# EAGLE design lights (EAGLE 6.6.0)
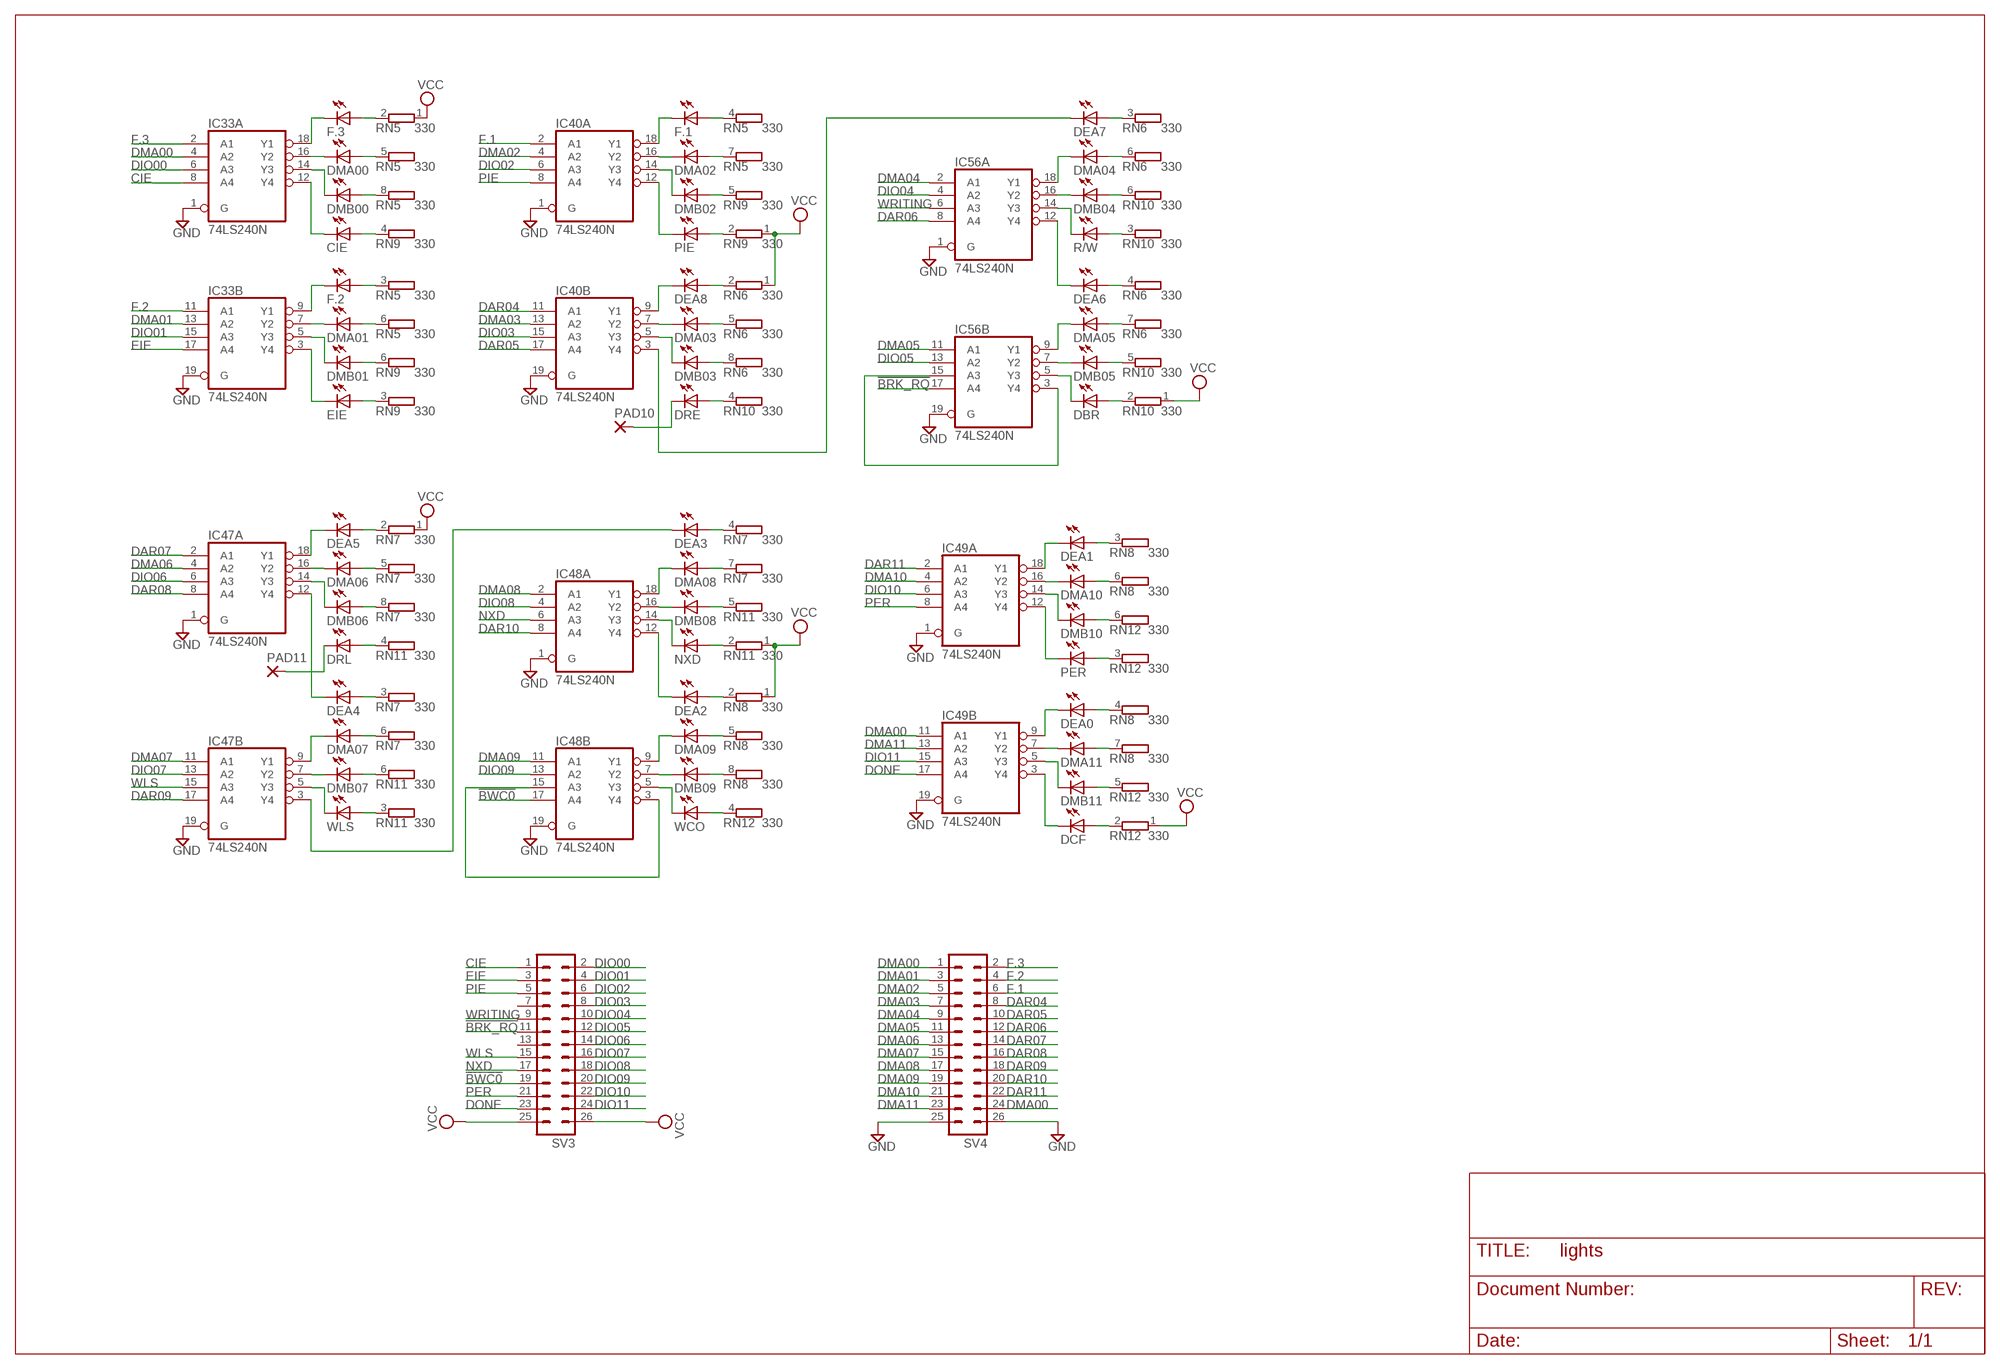
[diagram p0: schematic, sheet 1]

## Parts
CIE  LED5MM  [LED5MM]
DBR  LED5MM  [LED5MM]
DCF  LED5MM  [LED5MM]
DEA0  LED5MM  [LED5MM]
DEA1  LED5MM  [LED5MM]
DEA2  LED5MM  [LED5MM]
DEA3  LED5MM  [LED5MM]
DEA4  LED5MM  [LED5MM]
DEA5  LED5MM  [LED5MM]
DEA6  LED5MM  [LED5MM]
DEA7  LED5MM  [LED5MM]
DEA8  LED5MM  [LED5MM]
DMA00  LED5MM  [LED5MM]
DMA01  LED5MM  [LED5MM]
DMA02  LED5MM  [LED5MM]
DMA03  LED5MM  [LED5MM]
DMA04  LED5MM  [LED5MM]
DMA05  LED5MM  [LED5MM]
DMA06  LED5MM  [LED5MM]
DMA07  LED5MM  [LED5MM]
DMA08  LED5MM  [LED5MM]
DMA09  LED5MM  [LED5MM]
DMA10  LED5MM  [LED5MM]
DMA11  LED5MM  [LED5MM]
DMB00  LED5MM  [LED5MM]
DMB01  LED5MM  [LED5MM]
DMB02  LED5MM  [LED5MM]
DMB03  LED5MM  [LED5MM]
DMB04  LED5MM  [LED5MM]
DMB05  LED5MM  [LED5MM]
DMB06  LED5MM  [LED5MM]
DMB07  LED5MM  [LED5MM]
DMB08  LED5MM  [LED5MM]
DMB09  LED5MM  [LED5MM]
DMB10  LED5MM  [LED5MM]
DMB11  LED5MM  [LED5MM]
DRE  LED5MM  [LED5MM]
DRL  LED5MM  [LED5MM]
EIE  LED5MM  [LED5MM]
F.1  LED5MM  [LED5MM]
F.2  LED5MM  [LED5MM]
F.3  LED5MM  [LED5MM]
IC33  74LS240N  [DIL20]
IC40  74LS240N  [DIL20]
IC47  74LS240N  [DIL20]
IC48  74LS240N  [DIL20]
IC49  74LS240N  [DIL20]
IC56  74LS240N  [DIL20]
NXD  LED5MM  [LED5MM]
PAD10  1,6/0,8  [1,6/0,8]
PAD11  1,6/0,8  [1,6/0,8]
PER  LED5MM  [LED5MM]
PIE  LED5MM  [LED5MM]
R/W  LED5MM  [LED5MM]
RN5  330  GE07RP  [SIL8]
RN6  330  GE07RP  [SIL8]
RN7  330  GE07RP  [SIL8]
RN8  330  GE07RP  [SIL8]
RN9  330  GE05RP  [SIL6]
RN10  330  GE05RP  [SIL6]
RN11  330  GE05RP  [SIL6]
RN12  330  GE05RP  [SIL6]
SV3  MA13-2  [MA13-2]
SV4  MA13-2  [MA13-2]
WCO  LED5MM  [LED5MM]
WLS  LED5MM  [LED5MM]

## Nets
!BRK_RQ: IC56.17(B:A4) SV3.11
!BWC0: IC48.17(B:A4) SV3.19
CIE: IC33.8(A:A4) SV3.1
DAR04: IC40.11(B:A1) SV4.8
DAR05: IC40.17(B:A4) SV4.10
DAR06: IC56.8(A:A4) SV4.12
DAR07: IC47.2(A:A1) SV4.14
DAR08: IC47.8(A:A4) SV4.16
DAR09: IC47.17(B:A4) SV4.18
DAR10: IC48.8(A:A4) SV4.20
DAR11: IC49.2(A:A1) SV4.22
DIO00: IC33.6(A:A3) SV3.2
DIO01: IC33.15(B:A3) SV3.4
DIO02: IC40.6(A:A3) SV3.6
DIO03: IC40.15(B:A3) SV3.8
DIO04: IC56.4(A:A2) SV3.10
DIO05: IC56.13(B:A2) SV3.12
DIO06: IC47.6(A:A3) SV3.14
DIO07: IC47.13(B:A2) SV3.16
DIO08: IC48.4(A:A2) SV3.18
DIO09: IC48.13(B:A2) SV3.20
DIO10: IC49.6(A:A3) SV3.22
DIO11: IC49.15(B:A3) SV3.24
DMA00: IC33.4(A:A2) IC49.11(B:A1) SV4.1 SV4.24
DMA01: IC33.13(B:A2) SV4.3
DMA02: IC40.4(A:A2) SV4.5
DMA03: IC40.13(B:A2) SV4.7
DMA04: IC56.2(A:A1) SV4.9
DMA05: IC56.11(B:A1) SV4.11
DMA06: IC47.4(A:A2) SV4.13
DMA07: IC47.11(B:A1) SV4.15
DMA08: IC48.2(A:A1) SV4.17
DMA09: IC48.11(B:A1) SV4.19
DMA10: IC49.4(A:A2) SV4.21
DMA11: IC49.13(B:A2) SV4.23
DONE: IC49.17(B:A4) SV3.23
EIE: IC33.17(B:A4) SV3.3
F.1: IC40.2(A:A1) SV4.6
F.2: IC33.11(B:A1) SV4.4
F.3: IC33.2(A:A1) SV4.2
GND: IC33.1(A:G) IC33.19(B:G) IC40.1(A:G) IC40.19(B:G) IC47.1(A:G) IC47.19(B:G) IC48.1(A:G) IC48.19(B:G) IC49.1(A:G) IC49.19(B:G) IC56.1(A:G) IC56.19(B:G) SV4.25 SV4.26
N$42: F.3.A RN5.2
N$43: F.2.A RN5.3
N$44: F.1.A RN5.4
N$45: DEA8.A RN6.2
N$46: DEA2.A RN8.2
N$47: DEA1.A RN8.3
N$48: DEA5.A RN7.2
N$49: DEA4.A RN7.3
N$50: DEA3.A RN7.4
N$51: DEA0.A RN8.4
N$52: DMA09.A RN8.5
N$85: DMA10.A RN8.6
N$86: DMA00.A RN5.5
N$87: DMA01.A RN5.6
N$88: DMA02.A RN5.7
N$89: DEA7.A RN6.3
N$90: DEA6.A RN6.4
N$91: DMA03.A RN6.5
N$92: DMA07.A RN7.6
N$93: DMA06.A RN7.5
N$94: DMA08.A RN7.7
N$95: DMA11.A RN8.7
N$96: DMB09.A RN8.8
N$97: DMB10.A RN12.6
N$98: PIE.A RN9.2
N$99: EIE.A RN9.3
N$100: CIE.A RN9.4
N$101: DMA04.A RN6.6
N$102: DMA05.A RN6.7
N$103: DMB03.A RN6.8
N$104: DMB06.A RN7.8
N$105: DMB07.A RN11.6
N$106: DMB08.A RN11.5
N$107: DMB11.A RN12.5
N$108: RN12.4 WCO.A
N$109: PER.A RN12.3
N$110: DMB02.A RN9.5
N$111: DMB01.A RN9.6
N$112: DMB00.A RN5.8
N$113: DRE.A RN10.4
N$114: R/W.A RN10.3
N$115: DBR.A RN10.2
N$116: DRL.A RN11.4
N$117: RN11.3 WLS.A
N$118: NXD.A RN11.2
N$119: DCF.A RN12.2
N$120: DMA09.K(C) IC48.9(B:Y1)
N$121: DMB09.K(C) IC48.7(B:Y2)
N$122: F.3.K(C) IC33.18(A:Y1)
N$123: DMA00.K(C) IC33.16(A:Y2)
N$124: CIE.K(C) IC33.12(A:Y4)
N$125: DMB00.K(C) IC33.14(A:Y3)
N$126: DMA01.K(C) IC33.7(B:Y2)
N$127: F.2.K(C) IC33.9(B:Y1)
N$128: DMB01.K(C) IC33.5(B:Y3)
N$129: EIE.K(C) IC33.3(B:Y4)
N$132: F.1.K(C) IC40.18(A:Y1)
N$133: DMA02.K(C) IC40.16(A:Y2)
N$134: DMB02.K(C) IC40.14(A:Y3)
N$135: IC40.12(A:Y4) PIE.K(C)
N$136: DMB03.K(C) IC40.5(B:Y3)
N$137: DMA03.K(C) IC40.7(B:Y2)
N$138: DEA8.K(C) IC40.9(B:Y1)
N$139: DEA7.K(C) IC40.3(B:Y4)
N$140: DMA04.K(C) IC56.18(A:Y1)
N$141: DMB04.K(C) IC56.16(A:Y2)
N$142: IC56.14(A:Y3) R/W.K(C)
N$143: DMB05.K(C) IC56.7(B:Y2)
N$144: DEA6.K(C) IC56.12(A:Y4)
N$145: DBR.K(C) IC56.5(B:Y3)
N$146: DMA06.K(C) IC47.16(A:Y2)
N$147: DEA4.K(C) IC47.12(A:Y4)
N$148: DMB07.K(C) IC47.7(B:Y2)
N$149: DEA5.K(C) IC47.18(A:Y1)
N$150: DMA07.K(C) IC47.9(B:Y1)
N$151: IC47.5(B:Y3) WLS.K(C)
N$152: DMB06.K(C) IC47.14(A:Y3)
N$153: DEA3.K(C) IC47.3(B:Y4)
N$154: DMA08.K(C) IC48.18(A:Y1)
N$155: DMB08.K(C) IC48.16(A:Y2)
N$156: IC48.14(A:Y3) NXD.K(C)
N$157: IC48.5(B:Y3) WCO.K(C)
N$158: IC49.12(A:Y4) PER.K(C)
N$159: DMB10.K(C) IC49.14(A:Y3)
N$160: DEA2.K(C) IC48.12(A:Y4)
N$161: DMA10.K(C) IC49.16(A:Y2)
N$162: DEA1.K(C) IC49.18(A:Y1)
N$163: IC48.3(B:Y4) IC48.15(B:A3)
N$164: DMA11.K(C) IC49.7(B:Y2)
N$165: DEA0.K(C) IC49.9(B:Y1)
N$166: DMB11.K(C) IC49.5(B:Y3)
N$167: DCF.K(C) IC49.3(B:Y4)
N$169: DRE.K(C) PAD10.1(P)
N$170: DRL.K(C) PAD11.1(P)
N$171: DMA05.K(C) IC56.9(B:Y1)
N$172: DMB04.A RN10.6
N$173: DMB05.A RN10.5
N$175: IC56.3(B:Y4) IC56.15(B:A3)
NXD: IC48.6(A:A3) SV3.17
PER: IC49.8(A:A4) SV3.21
PIE: IC40.8(A:A4) SV3.5
VCC [Power]: RN5.1 RN6.1 RN7.1 RN8.1 RN9.1 RN10.1 RN11.1 RN12.1 SV3.25 SV3.26
WLS: IC47.15(B:A3) SV3.15
WRITING: IC56.6(A:A3) SV3.9
Unconnected: SV3.7 SV3.13

## Power pins joined to a net without a drawn wire
GND: IC33.10(P:GND) IC40.10(P:GND) IC47.10(P:GND) IC48.10(P:GND) IC49.10(P:GND) IC56.10(P:GND)
VCC: IC33.20(P:VCC) IC40.20(P:VCC) IC47.20(P:VCC) IC48.20(P:VCC) IC49.20(P:VCC) IC56.20(P:VCC)

## Library data of the parts
CIE DBR DCF DEA0 DEA1-DEA8 DMA00 DMA01-DMA09 DMA10 DMA11 DMB00 DMB01-DMB09 DMB10 DMB11 DRE DRL EIE F.1-F.3 NXD PER PIE R/W WCO WLS = led:LED: LED OSRAM: - CHIPLED LG R971, LG N971, LY N971, LG Q971, LY Q971, LO R971, LY R971 LH N974, LH R974 LS Q976, LO Q976, LY Q976 LO Q996 - Hyper CHIPLED LW Q18S LB Q993, LB Q99A, LB R99A - SideLED LS A670, LO A670, LY A670, LG A670, LP A670 LB A673, LV A673, LT A673, LW A673 LH A674 LY A675 LS A676, LA A676, LO A676, LY A676, LW A676 LS A679, LY A679, LG A679 - Hyper Micro SIDELED® LS Y876, LA Y876, LO Y876, LY Y876 LT Y87S - SmartLED LW L88C, LW L88S LB L89C, LB L89S, LG L890 LS L89K, LO L89K, LY L89K LS L896, LA L896, LO L896, LY L896 - TOPLED LS T670, LO T670, LY T670, LG T670, LP T670 LSG T670, LSP T670, LSY T670, LOP T670, LYG T670 LG T671, LOG T671, LSG T671 LB T673, LV T673, LT T673, LW T673 LH T674 LS T676, LA T676, LO T676, LY T676, LB T676, LH T676, LSB T676, LW T676 LB T67C, LV T67C, LT T67C, LS T67K, LO T67K, LY T67K, LW E67C LS E67B, LA E67B, LO E67B, LY E67B, LB E67C, LV E67C, LT E67C LW T67C LS T679, LY T679, LG T679 LS T770, LO T770, LY T770, LG T770, LP T770 LB T773, LV T773, LT T773, LW T773 LH T774 LS E675, LA E675, LY E675, LS T675 LS T776, LA T776, LO T776, LY T776, LB T776 LHGB T686 LT T68C, LB T68C - Hyper Mini TOPLED® LB M676 - Mini TOPLED Santana® LG M470 LS M47K, LO M47K, LY M47K Source: http://www.osram.convergy.de LUXEON: - LUMILED® LXK2-PW12-R00, LXK2-PW12-S00, LXK2-PW14-U00, LXK2-PW14-V00 LXK2-PM12-R00, LXK2-PM12-S00, LXK2-PM14-U00 LXK2-PE12-Q00, LXK2-PE12-R00, LXK2-PE12-S00, LXK2-PE14-T00, LXK2-PE14-U00 LXK2-PB12-K00, LXK2-PB12-L00, LXK2-PB12-M00, LXK2-PB14-N00, LXK2-PB14-P00, LXK2-PB14-Q00 LXK2-PR12-L00, LXK2-PR12-M00, LXK2-PR14-Q00, LXK2-PR14-R00 LXK2-PD12-Q00, LXK2-PD12-R00, LXK2-PD12-S00 LXK2-PH12-R00, LXK2-PH12-S00 LXK2-PL12-P00, LXK2-PL12-Q00, LXK2-PL12-R00 Source: www.luxeon.com KINGBRIGHT: KA-3528ASYC Source: www.kingbright.com
IC33 IC40 IC47-IC49 IC56 = 74xx-us:74*240: Octal BUFFER and LINE DRIVER, 3-state
PAD10 PAD11 = wirepad:1,6/0,8: THROUGH-HOLE PAD
RN5-RN8 = resistor-sil:GE07RP: SIL RESISTOR; OC_FARNELL: unknown; OC_NEWARK: unknown
RN9-RN12 = resistor-sil:GE05RP: SIL RESISTOR; OC_FARNELL: unknown; OC_NEWARK: unknown
SV3 SV4 = con-lstb:MA13-2: PIN HEADER; OC_FARNELL: unknown; OC_NEWARK: unknown

## Net classes
1 Power: width 0.508 mm

## Board
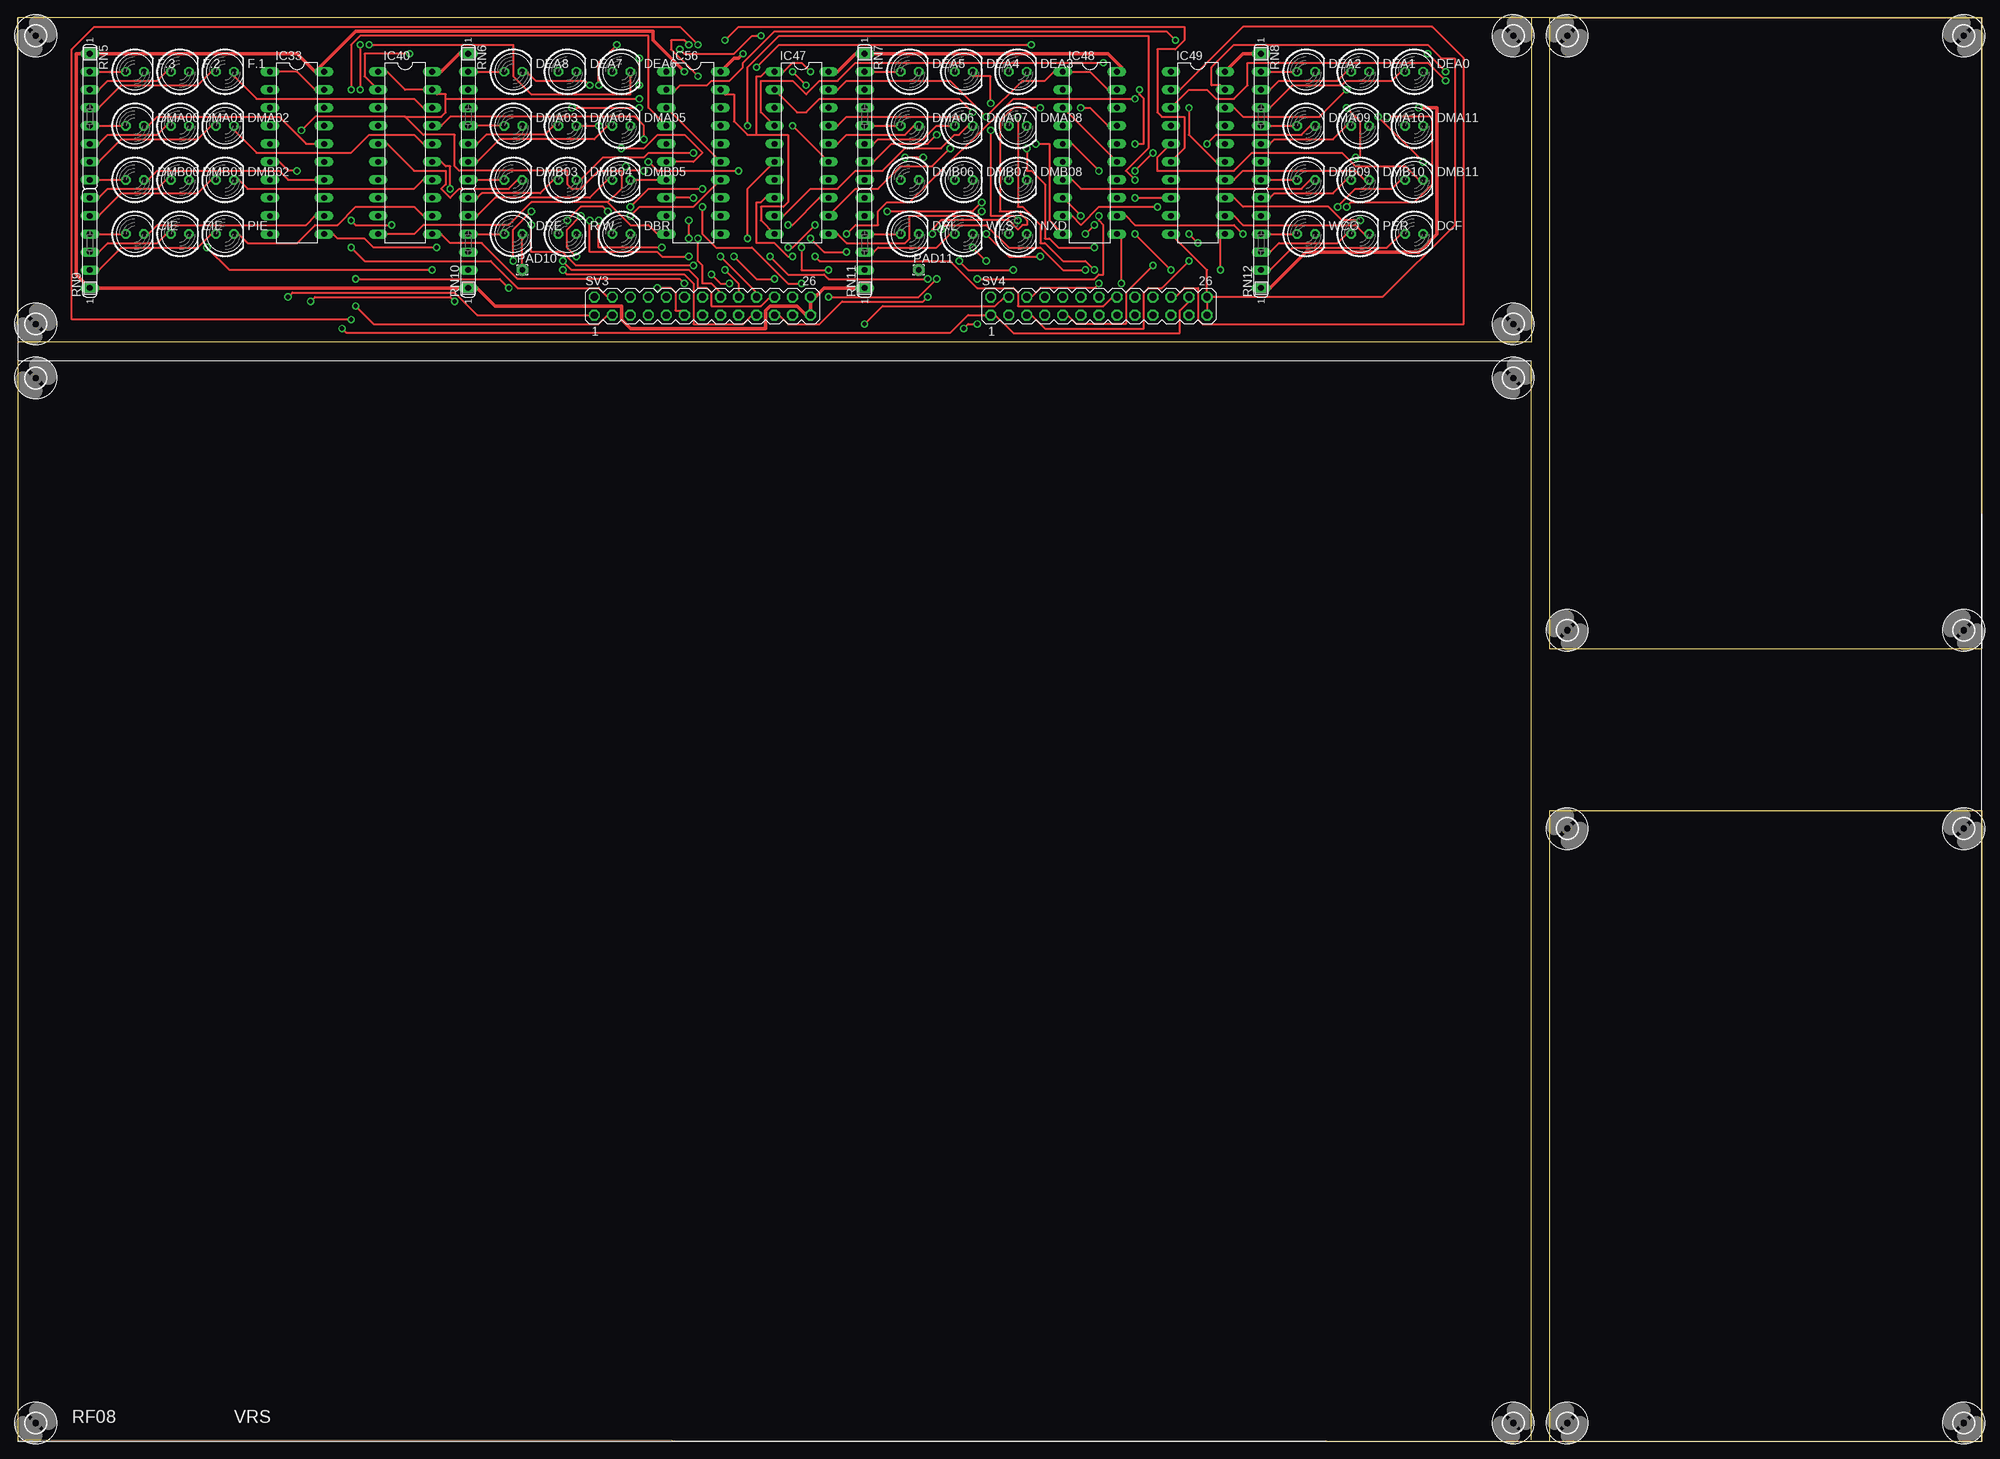
[diagram p1: board, top side]
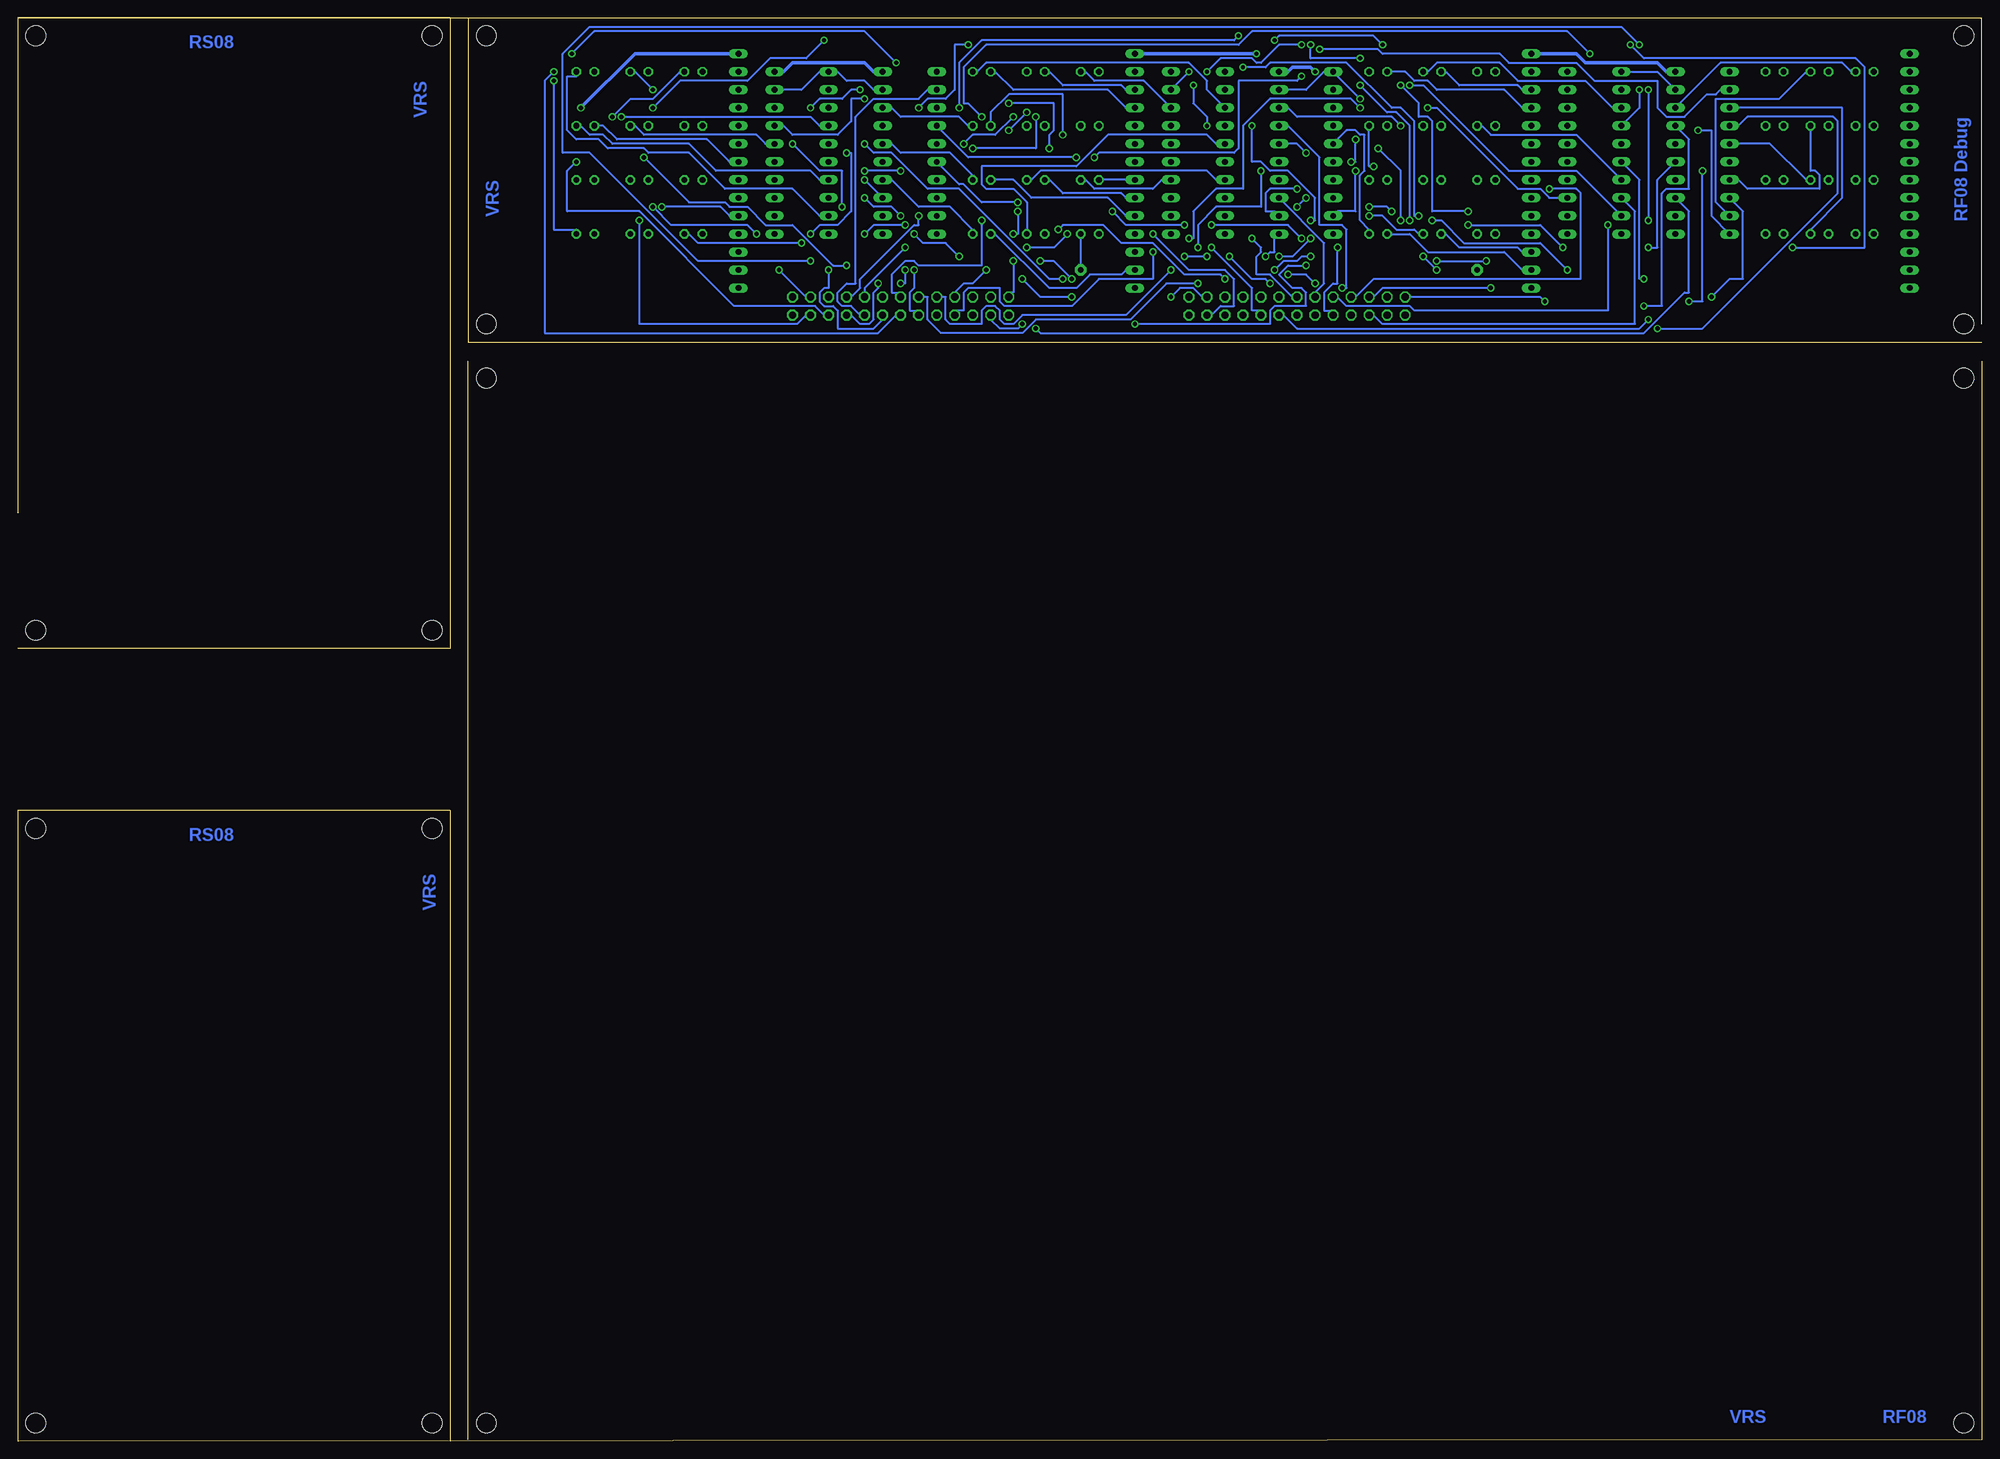
[diagram p2: board, bottom side, seen from below]

Size 276.86 x 200.67 mm. Coordinates in mm from the lower left corner, seen from the top.
Outline: 276.69,0 0.01,0.18 0.01,152.25
Outline: 213.34,0.18 213.34,152.25
Outline: 215.9,0.01 215.9,88.92 276.86,88.92 276.86,0.01
Outline: 276.86,111.78 215.9,111.78 215.9,200.67 276.86,200.67
Outline: 276.86,200.67 0,200.67 0,157.49
Outline: 276.86,200.67 276.86,130.82
Outline: 0,154.95 213.36,154.95 213.36,200.67
Copper layers (1*16): Top 0.035mm / dielectric 1.5mm / Bottom 0.035mm
Design rules "olimex10mil": minimum track width 10mil, minimum drill 24mil, track to track 10mil, track to pad 10mil, pad to pad 10mil, via to via 10mil, smd to smd 10mil, copper to edge 40mil, drill to drill 10mil, minimum pad ring 10mil, minimum via ring 8mil, stop-mask expansion 0mil, vias tented up to drill 0mil, thermal gap 10mil

### Footprints (pad centres in the part's own frame; a part is rotated, then mirrored left to right if it is on the bottom)
LED5MM = drill 0.813 octagon: A -1.27,0; K 1.27,0
DIL20 = drill 0.813 long: 1 -11.43,-3.81; 2 -8.89,-3.81; 3 -6.35,-3.81; 4 -3.81,-3.81; 5 -1.27,-3.81; 6 1.27,-3.81; 7 3.81,-3.81; 8 6.35,-3.81; 9 8.89,-3.81; 10 11.43,-3.81; 11 11.43,3.81; 12 8.89,3.81; 13 6.35,3.81; 14 3.81,3.81; 15 1.27,3.81; 16 -1.27,3.81; 17 -3.81,3.81; 18 -6.35,3.81; 19 -8.89,3.81; 20 -11.43,3.81
1,6/0,8 = drill 0.813 pad 1.6 octagon: 1 0,0
SIL8 = drill 0.813 long: 1 -8.89,0; 2 -6.35,0; 3 -3.81,0; 4 -1.27,0; 5 1.27,0; 6 3.81,0; 7 6.35,0; 8 8.89,0
SIL6 = drill 0.813 long: 1 -6.35,0; 2 -3.81,0; 3 -1.27,0; 4 1.27,0; 5 3.81,0; 6 6.35,0
MA13-2 = drill 1.016 octagon: 1 -15.24,-1.27; 2 -15.24,1.27; 3 -12.7,-1.27; 4 -12.7,1.27; 5 -10.16,-1.27; 6 -10.16,1.27; 7 -7.62,-1.27; 8 -7.62,1.27; 9 -5.08,-1.27; 10 -5.08,1.27; 11 -2.54,-1.27; 12 -2.54,1.27; 13 0,-1.27; 14 0,1.27; 15 2.54,-1.27; 16 2.54,1.27; 17 5.08,-1.27; 18 5.08,1.27; 19 7.62,-1.27; 20 7.62,1.27; 21 10.16,-1.27; 22 10.16,1.27; 23 12.7,-1.27; 24 12.7,1.27; 25 15.24,-1.27; 26 15.24,1.27
2,8 = hole 2.8: 0,0

### Placement (x,y rotation side)
CIE  16.51,170.19 0 top
DBR  85.09,170.19 0 top
DCF  196.85,170.19 0 top
DEA0  196.85,193.05 0 top
DEA1  189.23,193.05 0 top
DEA2  181.61,193.05 0 top
DEA3  140.97,193.05 0 top
DEA4  133.35,193.05 0 top
DEA5  125.73,193.05 0 top
DEA6  85.09,193.05 0 top
DEA7  77.47,193.05 0 top
DEA8  69.85,193.05 0 top
DMA00  16.51,185.43 0 top
DMA01  22.86,185.43 0 top
DMA02  29.21,185.43 0 top
DMA03  69.85,185.43 0 top
DMA04  77.47,185.43 0 top
DMA05  85.09,185.43 0 top
DMA06  125.73,185.43 0 top
DMA07  133.35,185.43 0 top
DMA08  140.97,185.43 0 top
DMA09  181.61,185.43 0 top
DMA10  189.23,185.43 0 top
DMA11  196.85,185.43 0 top
DMB00  16.51,177.81 0 top
DMB01  22.86,177.81 0 top
DMB02  29.21,177.81 0 top
DMB03  69.85,177.81 0 top
DMB04  77.47,177.81 0 top
DMB05  85.09,177.81 0 top
DMB06  125.73,177.81 0 top
DMB07  133.35,177.81 0 top
DMB08  140.97,177.81 0 top
DMB09  181.61,177.81 0 top
DMB10  189.23,177.81 0 top
DMB11  196.85,177.81 0 top
DRE  69.85,170.19 0 top
DRL  125.73,170.19 0 top
EIE  22.86,170.19 0 top
F.1  29.21,193.05 0 top
F.2  22.86,193.05 0 top
F.3  16.51,193.05 0 top
IC33  39.37,181.62 270 top
IC40  54.61,181.62 270 top
IC47  110.49,181.62 270 top
IC48  151.13,181.62 270 top
IC49  166.37,181.62 270 top
IC56  95.25,181.62 270 top
NXD  140.97,170.19 0 top
PAD10  71.12,165.11 0 top
PAD11  127,165.11 0 top
PER  189.23,170.19 0 top
PIE  29.21,170.19 0 top
R/W  77.47,170.19 0 top
RN5  10.16,186.7 270 top
RN6  63.5,186.7 270 top
RN7  119.38,186.7 270 top
RN8  175.26,186.7 270 top
RN9  10.16,168.92 90 top
RN10  63.5,168.92 90 top
RN11  119.38,168.92 90 top
RN12  175.26,168.92 90 top
SV3  96.52,160.03 0 top
SV4  152.4,160.03 0 top
U$1  [2,8]  2.54,149.88 0 top
U$2  [2,8]  210.82,149.88 0 top
U$3  [2,8]  2.54,2.56 0 top
U$4  [2,8]  210.82,2.56 0 top
U$5  [2,8]  274.32,2.56 90 top
U$6  [2,8]  218.44,2.56 90 top
U$7  [2,8]  218.44,86.38 90 top
U$8  [2,8]  274.32,86.38 90 top
U$9  [2,8]  274.32,198.13 90 top
U$10  [2,8]  274.32,114.31 90 top
U$11  [2,8]  218.44,114.31 90 top
U$12  [2,8]  218.44,198.13 90 top
U$13  [2,8]  2.54,157.49 0 top
U$14  [2,8]  2.54,198.13 0 top
U$16  [2,8]  210.82,157.49 0 top
U$17  [2,8]  210.82,198.13 0 top
U$18  [SIERRA-PROTO]  0,0.01 0 top
WCO  181.61,170.19 0 top
WLS  133.35,170.19 0 top

### Tracks (layer width: path | path; a pad name or v marks a point on that pad's centre or on a via)
!BRK_RQ  (via drill 0.61)
  Top 0.254: v90.17,162.57 92.08,162.57 92.71,161.94 92.71,159.4 93.98,159.4 SV3.11
  Bottom 0.254: v90.17,162.57 89.53,162.57 89.53,170.83 90.17,171.46 93.34,171.46 93.34,180.99 97.79,185.43 IC56.17
!BWC0  (via drill 0.61)
  Top 0.254: v149.86,187.97 151.13,187.97 153.67,185.43 IC48.17 | v142.88,196.86 107.31,196.86 v104.14,193.69 | v79.38,172.73 77.47,170.83 77.47,168.29 v78.74,167.02 | v76.83,165.11 77.47,164.48 93.98,164.48 95.25,163.21 95.25,157.49 102.23,157.49 103.5,158.76 SV3.19
  Bottom 0.254: v149.86,187.97 148.59,189.24 146.05,189.24 144.78,190.51 144.78,196.86 v142.88,196.86 | v104.14,193.69 100.97,193.69 100.33,194.32 89.53,194.32 83.19,187.97 81.92,187.97 80.01,186.07 80.01,172.73 v79.38,172.73 | v76.83,165.11 v78.74,167.02
CIE  (via drill 0.61)
  Top 0.254: v38.1,161.3 38.73,161.94 61.59,161.94 64.77,158.76 SV3.1
  Bottom 0.254: v38.1,161.3 35.56,163.84 33.66,163.84 33.66,173.37 IC33.8
DAR04  (via drill 0.61)
  Top 0.254: v93.98,163.21 93.34,163.84 70.48,163.84 65.41,168.92 60.96,168.92 59.69,170.19 IC40.11 | v97.79,164.48 99.06,163.21 v100.33,163.21 | v106.05,167.02 108.58,164.48 113.67,164.48 114.3,163.84 v128.27,163.84 | v132.72,166.38 133.99,165.11 v140.34,165.11
  Bottom 0.254: v93.98,163.21 95.25,164.48 v97.79,164.48 | v100.33,163.21 100.97,163.84 102.87,163.84 v106.05,167.02 | v128.27,163.84 130.81,166.38 v132.72,166.38 | v140.34,165.11 142.24,163.21 143.51,163.21 144.78,161.94 SV4.8
DAR05  (via drill 0.61)
  Top 0.254: v88.27,183.53 88.27,185.43 87,186.7 60.96,186.7 59.69,185.43 IC40.17 | v88.9,180.35 90.17,179.08 v101.6,179.08 | v110.49,168.29 110.49,165.11 v114.3,165.11
  Bottom 0.254: v88.27,183.53 88.27,180.35 v88.9,180.35 | v101.6,179.08 101.6,174 107.95,174 110.49,171.46 v110.49,168.29 | v114.3,165.11 120.65,158.76 135.25,158.76 136.53,157.49 137.79,157.49 138.43,158.13 138.43,159.4 139.06,160.03 140.34,160.03 140.97,159.4 140.97,157.49 145.41,157.49 146.05,158.13 146.05,161.3 SV4.10
DAR06  (via drill 0.61)
  Top 0.254: v96.52,174 96.52,170.19 98.42,168.29 103.5,168.29 108.58,163.21 v110.49,163.21 | v95.25,175.27 IC56.8
  Bottom 0.254: v96.52,174 v95.25,175.27 | v110.49,163.21 114.94,163.21 120.02,158.13 133.35,158.13 135.25,156.22 146.69,156.22 148.59,158.13 148.59,161.3 SV4.12
DAR07  (via drill 0.61)
  Top 0.254: v134.62,187.34 132.72,189.24 113.03,189.24 111.12,187.34 109.86,187.34 IC47.2 | v137.16,184.8 137.16,172.73 140.34,172.73 v140.97,172.1
  Bottom 0.254: v134.62,187.34 v137.16,184.8 | v140.97,172.1 140.97,165.75 149.86,165.75 150.5,166.38 151.76,166.38 153.67,164.48 153.67,161.94 152.4,161.94 SV4.14
DAR08  (via drill 0.61)
  Top 0.254: v109.22,167.02 108.58,167.02 106.68,168.92 104.14,168.92 104.14,174.64 104.78,174.64 105.41,175.27 IC47.8 | v112.39,167.02 113.03,166.38 131.44,166.38 135.25,162.57 140.34,162.57 140.97,161.94 140.97,160.03 153.03,160.03 154.31,161.3 SV4.16
  Bottom 0.254: v109.22,167.02 v112.39,167.02
DAR09  (via drill 0.61)
  Top 0.254: v133.35,186.7 116.84,186.7 115.57,185.43 IC47.17 | v142.24,182.26 142.24,179.08 142.88,179.08 144.78,177.18 144.78,169.56 145.41,169.56 146.69,168.29 v151.76,168.29
  Bottom 0.254: v133.35,186.7 133.35,182.26 v142.24,182.26 | v151.76,168.29 157.48,162.57 SV4.18
DAR10  (via drill 0.61)
  Top 0.254: v149.86,172.73 IC48.8
  Bottom 0.254: v149.86,172.73 149.86,171.46 150.5,171.46 158.12,163.84 158.12,162.57 159.38,161.3 SV4.20
DAR11
  Top 0.254: IC49.2 163.83,190.51 172.72,199.4 199.39,199.4 203.84,194.96 203.84,157.49 167,157.49 166.37,158.13 166.37,162.57 164.47,162.57 163.19,161.3 SV4.22
DIO00  (via drill 0.61)
  Top 0.254: v39.37,179.08 38.1,179.08 36.83,180.35 IC33.6 | v41.27,160.67 41.91,161.3 60.96,161.3 v61.59,160.67
  Bottom 0.254: v39.37,179.08 39.37,160.67 v41.27,160.67 | v61.59,160.67 62.23,161.3 SV3.2
DIO01  (via drill 0.61)
  Top 0.254: v46.99,168.29 48.9,166.38 66.67,166.38 70.48,162.57 81.92,162.57 83.19,161.3 SV3.4
  Bottom 0.254: v46.99,168.29 45.72,168.29 45.72,177.81 IC33.15
DIO02  (via drill 0.61)
  Top 0.254: v47.62,163.84 67.94,163.84 v69.22,162.57
  Bottom 0.254: v47.62,163.84 48.26,163.84 48.26,177.81 IC40.6 | v69.22,162.57 84.45,162.57 85.72,161.3 SV3.6
DIO03  (via drill 0.61)
  Top 0.254: v60.96,176.54 60.96,179.72 60.33,179.72 59.69,180.35 IC40.15
  Bottom 0.254: v60.96,176.54 57.15,176.54 56.52,175.91 56.52,163.84 85.72,163.84 88.27,161.3 SV3.8
DIO04  (via drill 0.61)
  Top 0.254: v46.99,190.51 46.99,196.86 48.26,198.13 88.9,198.13 88.9,187.97 IC56.4 | v46.99,172.1 47.62,171.46 v52.7,171.46
  Bottom 0.254: v46.99,190.51 v46.99,172.1 | v52.7,171.46 52.7,159.4 80.01,159.4 80.64,160.03 89.53,160.03 90.81,161.3 SV3.10
DIO05
  Bottom 0.254: IC56.13 92.71,168.92 92.71,163.21 93.98,161.94 SV3.12
DIO06  (via drill 0.61)
  Top 0.254: v102.87,169.56 102.87,176.54 IC47.6
  Bottom 0.254: v102.87,169.56 101.6,168.29 101.6,167.65 102.23,167.02 102.23,164.48 100.33,164.48 97.16,161.3 SV3.14
DIO07  (via drill 0.61)
  Top 0.254: v108.58,171.46 109.22,171.46 113.03,175.27 IC47.13 | v95.89,169.56 95.89,166.38 96.52,165.75 96.52,163.21 97.79,163.21 99.06,161.94 SV3.16
  Bottom 0.254: v108.58,171.46 97.79,171.46 v95.89,169.56
DIO08  (via drill 0.61)
  Top 0.254: v125.09,180.99 v127.64,180.99 | v95.89,192.42 92.08,196.23 92.08,197.5 93.98,197.5 v94.61,196.86 | v87.63,191.15 v87.63,194.96 | v80.64,172.1 80.64,167.65 90.17,167.65 90.81,167.02 v94.61,167.02 | v99.69,165.11 101.6,163.21 SV3.18
  Bottom 0.254: v127.64,180.99 142.88,180.99 IC48.4 | v125.09,180.99 124.46,181.62 105.41,181.62 104.78,182.26 104.78,191.78 96.52,191.78 v95.89,192.42 | v94.61,196.86 94.61,194.96 v87.63,194.96 | v87.63,191.15 83.82,187.34 82.55,187.34 80.64,185.43 v80.64,172.1 | v94.61,167.02 95.89,167.02 96.52,166.38 98.42,166.38 v99.69,165.11
DIO09  (via drill 0.61)
  Top 0.254: v157.48,177.81 156.21,179.08 159.38,182.26 159.38,198.13 107.31,198.13 102.87,193.69 v102.87,185.43 | v94.61,169.56 v94.61,172.1 | v99.06,167.02 104.14,161.94 SV3.20
  Bottom 0.254: v102.87,185.43 102.87,180.35 101.6,180.35 100.33,179.08 97.79,179.08 93.98,175.27 93.98,172.1 v94.61,172.1 | v94.61,169.56 97.16,167.02 v99.06,167.02 | v157.48,177.81 IC48.13
DIO10  (via drill 0.61)
  Top 0.254: v99.69,197.5 101.6,199.4 164.47,199.4 164.47,197.5 163.19,196.23 160.66,196.23 160.66,187.34 161.29,186.7 164.47,186.7 164.47,182.26 IC49.6 | v84.45,196.86 81.92,194.32 v81.92,191.15 | v72.39,173.37 69.85,170.83 v69.85,166.38 | v76.83,166.38 78.11,165.11 94.61,165.11 95.89,163.84 95.89,162.57 97.16,162.57 97.79,161.94 97.79,160.03 104.78,160.03 106.05,161.3 SV3.22
  Bottom 0.254: v99.69,197.5 99.06,198.13 85.72,198.13 v84.45,196.86 | v81.92,191.15 79.38,188.61 79.38,186.7 78.11,186.7 77.47,186.07 77.47,173.37 v72.39,173.37 | v76.83,166.38 v69.85,166.38
DIO11  (via drill 0.61)
  Top 0.254: v165.1,187.97 165.1,184.16 168.91,180.35 IC49.15 | v158.12,190.51 158.12,189.88 158.75,189.24 158.75,182.89 v157.48,182.89 | v129.54,163.84 127,161.3 v114.3,161.3
  Bottom 0.254: v165.1,187.97 163.83,189.24 160.66,189.24 159.38,190.51 v158.12,190.51 | v157.48,182.89 156.21,181.62 153.67,181.62 148.59,176.54 144.15,176.54 131.44,163.84 v129.54,163.84 | v114.3,161.3 113.03,162.57 111.12,162.57 109.86,161.3 SV3.24
DMA00  (via drill 0.61)
  Top 0.254: v169.54,165.11 169.54,169.56 IC49.11 | v45.72,156.86 46.35,156.22 131.44,156.22 133.99,158.76 SV4.1 137.79,158.76 140.34,156.22 163.83,156.22 163.83,159.4 165.1,160.67 SV4.24
  Bottom 0.254: v169.54,165.11 165.74,161.3 SV4.24 | v45.72,156.86 39.37,156.86 20.32,175.91 20.32,186.07 20.95,186.7 33.02,186.7 34.29,185.43 IC33.4
DMA01  (via drill 0.61)
  Top 0.254: v133.35,156.86 133.99,157.49 v135.25,157.49
  Bottom 0.254: v133.35,156.86 132.72,156.22 47.62,156.22 41.91,161.94 41.27,161.94 41.27,173.37 IC33.13 | v135.25,157.49 135.89,156.86 138.43,156.86 139.7,158.13 SV4.3
DMA02  (via drill 0.61)
  Top 0.254: v48.26,196.86 v48.26,190.51 | v165.1,166.38 161.29,162.57 159.38,162.57 158.75,161.94 158.75,156.86 144.78,156.86 142.88,158.76 SV4.5
  Bottom 0.254: v48.26,190.51 48.26,187.97 IC40.4 | v48.26,196.86 50.8,199.4 196.22,199.4 200.03,195.59 200.03,181.62 196.22,181.62 180.97,166.38 v165.1,166.38
DMA03  (via drill 0.61)
  Top 0.254: v78.11,187.97 v87.63,187.97 | v111.76,169.56 113.67,167.65 v116.84,167.65
  Bottom 0.254: v78.11,187.97 76.83,187.97 65.41,176.54 62.23,176.54 60.96,175.27 IC40.13 | v87.63,187.97 88.9,189.24 100.33,189.24 104.14,185.43 104.14,176.54 107.95,176.54 111.12,173.37 111.12,169.56 v111.76,169.56 | v116.84,167.65 116.84,163.84 124.46,163.84 128.27,160.03 137.79,160.03 138.43,160.67 138.43,162.57 142.88,162.57 143.51,161.94 143.51,159.4 144.78,159.4 SV4.7
DMA04  (via drill 0.61)
  Top 0.254: v163.19,197.5 161.93,198.77 106.68,198.77 102.23,194.32 102.23,193.69 100.33,191.78 97.79,191.78 97.16,191.15 93.34,191.15 92.71,190.51 IC56.2 | v187.32,187.97 189.23,186.07 189.23,180.99 v188.59,180.99 | v160.02,165.75 156.21,161.94 156.21,157.49 149.22,157.49 147.96,158.76 SV4.9
  Bottom 0.254: v163.19,197.5 165.74,194.96 170.81,194.96 173.99,191.78 183.51,191.78 v187.32,187.97 | v188.59,180.99 182.25,174.64 177.16,174.64 176.53,174 173.99,174 171.45,171.46 167.64,171.46 161.93,165.75 v160.02,165.75
DMA05  (via drill 0.61)
  Top 0.254: v100.97,167.02 104.14,163.84 v106.68,163.84 | v130.18,170.83 130.81,171.46 136.53,171.46 139.7,168.29 144.15,168.29 147.32,165.11 v150.5,165.11
  Bottom 0.254: v100.97,167.02 100.33,167.65 99.69,167.65 99.69,169.56 IC56.11 | v106.68,163.84 107.31,164.48 112.39,164.48 116.84,168.92 121.28,168.92 123.83,171.46 129.54,171.46 v130.18,170.83 | v150.5,165.11 150.5,162.57 151.13,161.94 151.13,159.4 149.86,159.4 SV4.11
DMA06  (via drill 0.61)
  Top 0.254: v153.03,194.32 118.11,194.32 115.57,191.78 113.03,191.78 111.12,189.88 109.22,191.78 104.78,191.78 104.78,187.34 IC47.4 | v198.75,195.59 v201.29,193.05
  Bottom 0.254: v153.03,194.32 157.48,198.77 195.58,198.77 v198.75,195.59 | v201.29,193.05 202.56,191.78 202.56,156.22 155.57,156.22 153.03,158.76 SV4.13
DMA07  (via drill 0.61)
  Top 0.254: v135.89,173.37 135.25,172.73 125.73,172.73 125.73,169.56 125.09,168.92 116.84,168.92 115.57,170.19 IC47.11 | v136.53,170.19 139.7,167.02 v144.15,167.02 | v150.5,170.19 v151.76,171.46 | v157.48,170.19 v162.56,165.11
  Bottom 0.254: v135.89,173.37 135.89,170.19 v136.53,170.19 | v144.15,167.02 146.05,168.92 149.22,168.92 v150.5,170.19 | v151.76,171.46 156.21,171.46 v157.48,170.19 | v162.56,165.11 162.56,162.57 163.19,162.57 163.83,161.94 163.83,160.67 163.19,160.03 161.93,160.03 161.29,159.4 161.29,156.86 156.21,156.86 154.94,158.13 SV4.15
DMA08
  Bottom 0.254: IC48.2 148.59,190.51 149.86,189.24 156.21,189.24 158.75,186.7 158.75,163.21 160.02,163.21 161.29,161.94 161.29,160.67 160.66,160.03 159.38,160.03 158.12,158.76 SV4.17
DMA09  (via drill 0.61)
  Top 0.254: v155.57,163.21 155.57,169.56 IC48.11
  Bottom 0.254: v155.57,163.21 155.57,162.57 156.21,161.94 156.21,158.13 156.84,157.49 158.12,157.49 159.38,158.76 SV4.19
DMA10  (via drill 0.61)
  Top 0.254: v198.12,180.35 v191.77,186.7
  Bottom 0.254: v191.77,186.7 165.1,186.7 163.83,185.43 IC49.4 | v198.12,180.35 199.39,179.08 199.39,173.37 189.23,173.37 175.9,160.03 164.47,160.03 163.19,158.76 SV4.21
DMA11  (via drill 0.61)
  Top 0.254: v189.23,172.1 186.69,172.1 184.78,174 172.72,174 171.45,175.27 IC49.13
  Bottom 0.254: v189.23,172.1 189.23,157.49 167,157.49 165.74,158.76 SV4.23
DONE  (via drill 0.61)
  Top 0.254: v157.48,189.24 140.34,189.24 125.73,174.64 122.56,174.64 121.28,173.37 121.28,171.46 118.11,171.46 v116.84,170.19
  Bottom 0.254: v157.48,189.24 159.38,189.24 159.38,186.07 161.29,184.16 167.64,184.16 168.91,185.43 IC49.17 | v116.84,170.19 111.76,165.11 106.68,165.11 105.41,163.84 105.41,160.03 107.31,160.03 108.58,158.76 SV3.23
EIE  (via drill 0.61)
  Top 0.254: v47.62,160.03 50.16,157.49 81.92,157.49 83.19,158.76 SV3.3
  Bottom 0.254: v47.62,160.03 45.09,160.03 45.09,175.91 44.45,176.54 41.27,176.54 41.27,183.53 IC33.17
F.1  (via drill 0.61)
  Top 0.254: v55.24,195.59 48.9,195.59 48.9,192.42 IC40.2 | v140.97,186.7 140.97,174 141.6,174 144.15,171.46 144.15,168.92 144.78,168.92 147.32,166.38 150.5,166.38 v151.76,165.11 | v152.4,163.21 151.76,162.57 144.15,162.57 142.88,161.3 SV4.6
  Bottom 0.254: v55.24,195.59 58.42,198.77 102.87,198.77 104.78,196.86 140.34,196.86 143.51,193.69 143.51,188.61 142.88,188.61 v140.97,186.7 | v151.76,165.11 151.76,163.21 v152.4,163.21
F.2  (via drill 0.61)
  Top 0.254: v59.05,168.29 50.16,168.29 48.9,169.56 45.09,169.56 44.45,170.19 IC33.11 | v72.39,171.46 72.39,167.65 76.83,167.65 78.74,165.75 v95.25,165.75 | v119.38,157.49 121.92,160.03 137.79,160.03 139.06,161.3 SV4.4
  Bottom 0.254: v59.05,168.29 62.23,171.46 v72.39,171.46 | v95.25,165.75 97.79,165.75 99.06,164.48 97.16,162.57 95.89,162.57 95.25,161.94 95.25,160.03 99.69,160.03 100.33,159.4 100.33,157.49 v119.38,157.49
F.3  (via drill 0.61)
  Top 0.254: v93.34,196.23 93.98,195.59 100.97,195.59 103.5,198.13 v104.78,198.13 | v144.15,187.97 140.34,187.97 138.43,186.07 138.43,173.37 140.97,173.37 142.24,172.1 142.24,171.46 141.6,171.46 140.97,170.83 139.7,172.1 130.18,172.1 128.91,170.83 v128.91,170.19 | v134.62,168.29 v136.53,166.38
  Bottom 0.254: v93.34,196.23 85.09,196.23 84.45,195.59 67.94,195.59 66.67,194.32 57.15,194.32 54.61,191.78 45.72,191.78 45.72,187.97 44.45,186.7 41.91,186.7 38.73,189.88 37.47,189.88 36.83,190.51 IC33.2 | v104.78,198.13 105.41,197.5 140.97,197.5 144.15,194.32 v144.15,187.97 | v128.91,170.19 130.81,168.29 v134.62,168.29 | v136.53,166.38 136.53,161.94 137.16,161.94 SV4.2
GND  (via drill 0.61)
  Top 0.254: 83.19,174.64 72.39,174.64 69.22,171.46 57.15,171.46 55.88,170.19 IC40.10 | 83.19,174.64 86.36,171.46 88.9,171.46 90.17,170.19 IC56.10 | IC33.19 41.91,190.51 39.37,193.05 IC33.1 | v40.01,184.8 41.91,186.7 54.61,186.7 | 54.61,186.7 59.69,186.7 60.33,187.34 60.33,189.24 | 60.33,189.24 60.33,189.88 59.05,189.88 IC40.19 54.61,190.51 52.07,193.05 IC40.1 | 83.19,174.64 85.09,176.54 85.09,179.08 81.92,179.08 79.38,176.54 78.11,176.54 77.47,177.18 77.47,179.08 62.23,179.08 61.59,179.72 61.59,184.16 57.15,184.16 54.61,186.7 | 104.14,184.16 102.87,184.16 100.97,186.07 100.97,189.88 99.69,189.88 IC56.19 | 104.14,184.16 108.58,184.16 108.58,174.64 107.95,174 104.78,174 104.78,172.1 IC47.10 | 104.14,184.16 104.14,192.42 104.78,192.42 105.41,193.05 IC47.1 107.95,193.05 109.22,194.32 110.49,194.32 v111.76,193.05 | IC49.10 167.64,165.11 SV4.26 | SV4.26 SV4.25 | v143.51,182.89 145.41,182.89 145.41,172.1 IC48.10 | IC47.19 115.57,190.51 116.84,191.78 131.44,191.78 v136.53,186.7 141.6,191.78 144.78,191.78 146.05,193.05 IC48.1 151.13,193.05 153.67,190.51 IC48.19 | SV4.26 192.41,161.3 202.56,171.46 202.56,194.96 200.66,194.96 198.75,196.86 171.45,196.86 168.28,193.69 168.28,191.15 169.54,191.15 IC49.19 | 60.33,189.24 v87.63,189.24
  Bottom 0.254: v40.01,184.8 38.1,184.8 38.1,172.73 IC33.10 | IC33.19 45.72,193.05 IC40.1 | IC56.19 95.25,190.51 92.71,193.05 IC56.1 v87.63,189.24 | IC49.19 166.37,190.51 163.83,193.05 IC49.1 161.29,193.05 160.02,191.78 157.48,191.78 156.21,190.51 IC48.19 | v143.51,182.89 142.24,184.16 139.06,184.16 v136.53,186.7 | v111.76,193.05 IC47.19
N$42
  Top 0.254: RN5.2 F.3.A
N$43
  Top 0.254: RN5.3 11.43,190.51 12.7,191.78 19.68,191.78 20.95,193.05 F.2.A
N$44
  Top 0.254: RN5.4 11.43,187.97 14.61,191.15 25.4,191.15 27.3,193.05 F.1.A
N$45
  Top 0.254: RN6.2 DEA8.A
N$46
  Top 0.254: RN8.2 DEA2.A
N$47
  Top 0.254: RN8.3 176.53,190.51 177.8,191.78 186.06,191.78 187.32,193.05 DEA1.A
N$48
  Top 0.254: RN7.2 DEA5.A
N$49
  Bottom 0.254: RN7.3 120.65,190.51 121.28,191.15 129.54,191.15 131.44,193.05 DEA4.A
N$50
  Bottom 0.254: RN7.4 120.65,187.97 123.19,190.51 136.53,190.51 139.06,193.05 DEA3.A
N$51
  Top 0.254: RN8.4 176.53,187.97 179.71,191.15 186.69,191.15 187.32,191.78 193.68,191.78 194.94,193.05 DEA0.A
N$52
  Top 0.254: RN8.5 DMA09.A
N$85
  Top 0.254: RN8.6 176.53,182.89 177.16,183.53 185.42,183.53 187.32,185.43 DMA10.A
N$86
  Top 0.254: RN5.5 DMA00.A
N$87
  Top 0.254: RN5.6 11.43,182.89 12.7,184.16 19.68,184.16 20.95,185.43 DMA01.A
N$88
  Top 0.254: RN5.7 11.43,180.35 14.61,183.53 25.4,183.53 27.3,185.43 DMA02.A
N$89
  Bottom 0.254: RN6.3 64.77,190.51 65.41,191.15 73.66,191.15 75.56,193.05 DEA7.A
N$90
  Bottom 0.254: RN6.4 64.77,187.97 67.31,190.51 76.83,190.51 78.11,191.78 80.01,191.78 81.28,193.05 DEA6.A
N$91
  Top 0.254: DMA03.A RN6.5
N$92
  Top 0.254: RN7.6 120.65,182.89 121.28,183.53 127.64,183.53 129.54,185.43 DMA07.A
N$93
  Top 0.254: RN7.5 DMA06.A
N$94  (via drill 0.61)
  Top 0.254: v129.54,184.16 128.27,182.89 123.19,182.89 120.65,180.35 RN7.7
  Bottom 0.254: v129.54,184.16 129.54,189.88 137.16,189.88 139.7,187.34 DMA08.A
N$95
  Bottom 0.254: RN8.7 176.53,180.35 179.71,183.53 192.41,183.53 194.31,185.43 DMA11.A
N$96
  Top 0.254: RN8.8 DMB09.A
N$97
  Top 0.254: RN12.6 176.53,175.27 177.16,175.91 185.42,175.91 187.32,177.81 DMB10.A
N$98
  Top 0.254: RN9.2 11.43,165.11 14.61,168.29 25.4,168.29 27.3,170.19 PIE.A
N$99
  Top 0.254: RN9.3 11.43,167.65 12.7,168.92 19.68,168.92 20.95,170.19 EIE.A
N$100
  Top 0.254: RN9.4 CIE.A
N$101
  Top 0.254: RN6.6 64.77,182.89 66.04,184.16 74.3,184.16 75.56,185.43 DMA04.A
N$102
  Top 0.254: RN6.7 64.77,180.35 67.94,183.53 81.28,183.53 83.19,185.43 DMA05.A
N$103
  Top 0.254: RN6.8 DMB03.A
N$104
  Bottom 0.254: RN7.8 DMB06.A
N$105
  Bottom 0.254: RN11.6 120.65,175.27 121.28,175.91 129.54,175.91 131.44,177.81 DMB07.A
N$106
  Bottom 0.254: RN11.5 120.65,172.73 123.19,175.27 133.99,175.27 136.53,177.81 DMB08.A
N$107  (via drill 0.61)
  Top 0.254: v186.06,174 188.59,176.54 193.68,176.54 194.94,177.81 DMB11.A
  Bottom 0.254: v186.06,174 177.8,174 176.53,172.73 RN12.5
N$108
  Top 0.254: RN12.4 WCO.A
N$109
  Top 0.254: RN12.3 176.53,167.65 177.8,168.92 186.06,168.92 187.32,170.19 PER.A
N$110
  Top 0.254: RN9.5 11.43,172.73 14.61,175.91 25.4,175.91 27.3,177.81 DMB02.A
N$111
  Top 0.254: RN9.6 11.43,175.27 12.7,176.54 19.68,176.54 20.95,177.81 DMB01.A
N$112
  Top 0.254: RN5.8 DMB00.A
N$113
  Top 0.254: RN10.4 DRE.A
N$114
  Bottom 0.254: RN10.3 64.77,167.65 65.41,168.29 73.66,168.29 75.56,170.19 R/W.A
N$115
  Bottom 0.254: RN10.2 64.77,165.11 67.31,167.65 78.11,167.65 80.64,170.19 DBR.A
N$116
  Top 0.254: RN11.4 DRL.A
N$117
  Top 0.254: RN11.3 120.65,167.65 121.28,168.29 129.54,168.29 131.44,170.19 WLS.A
N$118
  Bottom 0.254: RN11.2 120.65,165.11 121.28,164.48 125.73,164.48 127.64,162.57 131.44,162.57 139.06,170.19 NXD.A
N$119
  Top 0.254: RN12.2 176.53,165.11 179.71,168.29 193.04,168.29 194.94,170.19 DCF.A
N$120  (via drill 0.61)
  Top 0.254: v160.66,174 152.4,174 149.86,171.46 148.59,172.73 IC48.9 | v167.64,182.89 168.91,184.16 180.97,184.16 182.25,185.43 DMA09.K
  Bottom 0.254: v160.66,174 160.66,179.08 163.83,179.08 v167.64,182.89
N$121
  Top 0.254: IC48.7 148.59,177.81 149.86,176.54 180.97,176.54 182.25,177.81 DMB09.K
N$122
  Bottom 0.254: F.3.K 18.41,193.05 19.68,194.32 36.83,194.32 IC33.18
N$123
  Top 0.254: DMA00.K 18.41,185.43 19.68,186.7 36.83,186.7 40.64,182.89 IC33.16
N$124
  Top 0.254: CIE.K 18.41,170.19 19.68,171.46 40.64,171.46 41.91,172.73 IC33.12
N$125
  Top 0.254: DMB00.K 18.41,177.81 19.68,179.08 36.83,179.08 38.1,177.81 IC33.14
N$126
  Bottom 0.254: DMA01.K 24.13,179.08 23.5,179.08 22.86,178.45 22.86,176.54 33.02,176.54 34.29,177.81 IC33.7
N$127
  Bottom 0.254: IC33.9 37.47,174.64 37.47,189.24 28.57,189.24 24.77,193.05 F.2.K
N$128
  Bottom 0.254: DMB01.K 24.77,177.81 29.84,182.89 IC33.5
N$129
  Bottom 0.254: EIE.K 24.13,170.83 19.68,175.27 19.68,187.97 IC33.3
N$132
  Top 0.254: F.1.K 30.48,192.42 33.66,189.24 55.88,189.24 57.15,187.97 IC40.18
N$133
  Top 0.254: DMA02.K 30.48,184.8 33.66,181.62 46.99,181.62 49.53,184.16 55.88,184.16 57.15,182.89 IC40.16
N$134
  Top 0.254: DMB02.K 31.11,177.81 32.38,176.54 55.88,176.54 57.15,177.81 IC40.14
N$135
  Top 0.254: PIE.K 31.11,170.19 32.38,168.92 39.37,168.92 41.91,171.46 45.09,171.46 47.62,174 55.88,174 57.15,172.73 IC40.12
N$136
  Top 0.254: DMB03.K 70.48,177.81 69.22,176.54 62.23,176.54 60.96,175.27 59.69,176.54 60.33,177.18 60.33,179.08 55.88,179.08 52.07,182.89 IC40.5
N$137
  Bottom 0.254: IC40.7 57.15,184.16 69.22,184.16 70.48,185.43 DMA03.K
N$138  (via drill 0.61)
  Top 0.254: v80.64,191.15 80.01,191.78 73.03,191.78 71.75,193.05 DEA8.K
  Bottom 0.254: v80.64,191.15 78.74,191.15 66.67,179.08 57.15,179.08 IC40.9
N$139
  Bottom 0.254: IC40.3 52.07,187.97 55.88,191.78 65.41,191.78 67.94,194.32 76.83,194.32 78.11,193.05 DEA7.K
N$140  (via drill 0.61)
  Top 0.254: DMA04.K v81.92,185.43
  Bottom 0.254: v81.92,185.43 83.19,186.7 96.52,186.7 97.79,187.97 IC56.18
N$141  (via drill 0.61)
  Top 0.254: v95.25,181.62 88.9,181.62 88.27,180.99 82.55,180.99 79.38,177.81 DMB04.K
  Bottom 0.254: v95.25,181.62 96.52,182.89 IC56.16
N$142  (via drill 0.61)
  Top 0.254: v86.36,172.73 87.63,174 95.25,174 IC56.14
  Bottom 0.254: v86.36,172.73 84.45,172.73 82.55,170.83 80.01,170.83 79.38,170.19 R/W.K
N$143
  Top 0.254: DMB05.K IC56.7
N$144  (via drill 0.61)
  Top 0.254: v49.53,196.86 69.85,196.86 69.85,192.42 72.39,189.88 86.36,189.88 DEA6.K | v26.67,168.29 29.84,165.11 v58.42,165.11 | v77.47,172.1 79.38,174 82.55,174 v83.19,173.37 | v86.36,174 88.9,176.54 v96.52,176.54
  Bottom 0.254: v49.53,196.86 47.62,194.96 17.78,194.96 16.51,193.69 16.51,168.29 v26.67,168.29 | v58.42,165.11 62.23,168.92 73.03,168.92 76.2,172.1 v77.47,172.1 | v83.19,173.37 83.82,174 v86.36,174 | v96.52,176.54 100.33,176.54 100.97,175.91 100.97,173.37 99.69,173.37 IC56.12
N$145
  Bottom 0.254: DBR.K 86.36,170.83 87.63,172.1 87.63,178.45 87,179.08 87,184.16 87.63,184.16 88.27,184.8 89.53,184.8 IC56.5
N$146
  Top 0.254: IC47.16 115.57,182.89 116.84,184.16 125.09,184.16 126.36,185.43 DMA06.K
N$147  (via drill 0.61)
  Top 0.254: v131.44,182.26 128.91,179.72 124.46,179.72 121.28,176.54 118.11,176.54 IC47.12 | v137.16,188.61 137.16,192.42 134.62,192.42 DEA4.K
  Bottom 0.254: v131.44,182.26 131.44,184.16 130.81,184.8 130.81,188.61 v137.16,188.61
N$148
  Bottom 0.254: IC47.7 107.95,177.81 109.22,179.08 132.72,179.08 133.99,177.81 DMB07.K
N$149
  Bottom 0.254: IC47.18 118.11,191.78 125.09,191.78 126.36,193.05 DEA5.K
N$150
  Top 0.254: IC47.9 107.95,172.73 111.76,176.54 115.57,176.54 118.11,179.08 121.92,179.08 125.09,182.26 130.18,182.26 132.08,184.16 132.72,184.16 133.99,185.43 DMA07.K
N$151
  Bottom 0.254: WLS.K 134.62,174.64 136.53,176.54 140.34,176.54 140.97,177.18 140.97,179.72 127.64,179.72 123.19,184.16 109.22,184.16 107.95,182.89 IC47.5
N$152
  Bottom 0.254: IC47.14 115.57,177.81 116.84,176.54 125.09,176.54 126.36,177.81 DMB06.K
N$153
  Bottom 0.254: IC47.3 109.22,190.51 109.22,191.78 111.76,194.32 140.34,194.32 141.6,193.05 DEA3.K
N$154
  Bottom 0.254: DMA08.K 142.88,185.43 144.15,186.7 152.4,186.7 153.67,187.97 IC48.18
N$155
  Bottom 0.254: DMB08.K 142.24,178.45 145.41,181.62 152.4,181.62 153.67,182.89 IC48.16
N$156
  Bottom 0.254: NXD.K 142.24,170.83 145.41,174 149.86,174 153.67,177.81 IC48.14
N$157  (via drill 0.61)
  Top 0.254: v165.1,170.19 v166.37,168.92 | v157.48,179.08 v160.02,181.62 | v152.4,179.08 148.59,182.89 IC48.5
  Bottom 0.254: v166.37,168.92 180.97,168.92 182.25,170.19 WCO.K | v165.1,170.19 163.83,171.46 161.29,171.46 159.38,173.37 159.38,181.62 v160.02,181.62 | v152.4,179.08 v157.48,179.08
N$158
  Top 0.254: PER.K 189.87,170.19 188.59,171.46 172.72,171.46 171.45,172.73 IC49.12
N$159
  Top 0.254: IC49.14 171.45,177.81 172.72,179.08 188.59,179.08 189.87,177.81 DMB10.K
N$160  (via drill 0.61)
  Top 0.254: v172.72,170.19 171.45,171.46 157.48,171.46 156.21,172.73 IC48.12 | v187.32,174 187.96,174.64 196.85,174.64 199.39,177.18 199.39,186.7 v193.04,186.7
  Bottom 0.254: v172.72,170.19 173.99,171.46 184.78,171.46 v187.32,174 | v193.04,186.7 190.5,189.24 187.32,189.24 183.51,193.05 DEA2.K
N$161
  Bottom 0.254: IC49.16 171.45,182.89 172.72,184.16 188.59,184.16 189.87,185.43 DMA10.K
N$162  (via drill 0.61)
  Top 0.254: v187.32,190.51 183.51,186.7 172.72,186.7 171.45,187.97 IC49.18
  Bottom 0.254: v187.32,190.51 189.87,193.05 DEA1.K
N$163
  Top 0.254: IC48.15 IC48.3
N$164
  Bottom 0.254: IC49.7 163.83,177.81 165.1,179.08 178.44,179.08 182.25,182.89 193.04,182.89 194.31,184.16 196.22,184.16 197.49,185.43 DMA11.K
N$165
  Bottom 0.254: IC49.9 163.83,172.73 167.64,176.54 177.16,176.54 182.25,181.62 187.96,181.62 188.59,182.26 193.68,182.26 194.94,183.53 198.12,183.53 199.39,184.8 199.39,192.42 198.12,192.42 DEA0.K
N$166
  Top 0.254: IC49.5 160.66,180.99 160.66,179.08 171.45,179.08 173.99,181.62 186.69,181.62 188.59,179.72 195.58,179.72 197.49,177.81 DMB11.K
N$167  (via drill 0.61)
  Top 0.254: v201.29,191.78 198.75,194.32 173.35,194.32 173.35,191.15 171.45,189.24 168.91,189.24 167.64,190.51 165.1,190.51 IC49.3
  Bottom 0.254: v201.29,191.78 201.29,170.83 198.12,170.83 DCF.K
N$169
  Top 0.254: PAD10.1 DRE.K
N$170
  Bottom 0.254: PAD11.1 DRL.K
N$171  (via drill 0.61)
  Top 0.254: v85.72,179.72 86.36,179.08 v88.27,179.08
  Bottom 0.254: v85.72,179.72 86.36,179.72 DMA05.K | v88.27,179.08 88.27,173.37 90.81,173.37 IC56.9
N$172
  Top 0.254: RN10.6 64.77,175.27 65.41,175.91 73.66,175.91 75.56,177.81 DMB04.A
N$173
  Top 0.254: RN10.5 64.77,172.73 67.31,175.27 80.64,175.27 83.19,177.81 DMB05.A
N$175
  Top 0.254: IC56.15 IC56.3
NXD  (via drill 0.61)
  Top 0.254: v135.89,174.64 134.62,173.37 v122.56,173.37 | v112.39,171.46 109.22,168.29 v108.58,168.29
  Bottom 0.254: v135.89,174.64 140.97,174.64 143.51,177.18 144.15,177.18 IC48.6 | v122.56,173.37 120.65,171.46 v112.39,171.46 | v108.58,168.29 102.87,162.57 102.87,159.4 101.6,159.4 SV3.17
PER  (via drill 0.61)
  Top 0.254: v152.4,172.73 152.4,172.1 153.03,171.46 153.03,164.48 152.4,164.48 151.76,163.84 v135.25,163.84 | v128.27,161.3 127.64,160.67 116.2,160.67 113.03,157.49 108.58,157.49 107.31,158.76 SV3.21 | v157.48,175.27 IC49.8
  Bottom 0.254: v157.48,175.27 156.21,174 153.67,174 v152.4,172.73 | v135.25,163.84 132.72,161.3 v128.27,161.3
PIE
  Bottom 0.254: IC40.8 48.9,173.37 48.9,157.49 84.45,157.49 85.72,158.76 SV3.5
VCC  (via drill 0.61)
  Top 0.508: v102.23,195.59 101.6,194.96 100.97,194.96 IC56.20 | IC47.20 115.57,193.05 118.11,195.59 RN7.1 153.67,195.59 155.57,193.69 IC48.20 | v197.49,187.97 200.03,187.97 200.03,170.19 197.49,167.65 181.61,167.65 176.53,162.57 RN12.1 | IC49.20 172.72,195.59 RN8.1 | IC40.20 59.69,193.05 62.23,195.59 RN6.1 | RN11.1 113.67,162.57 112.39,161.3 SV3.26 SV3.25 111.12,158.76 109.86,160.03 106.05,160.03 105.41,159.4 105.41,156.86 86.36,156.86 85.09,158.13 85.09,160.03 67.31,160.03 64.77,162.57 RN10.1 RN9.1 8.26,164.48 8.26,195.59 RN5.1 39.37,195.59 41.91,193.05 IC33.20 42.55,193.69 47.62,198.77 89.53,198.77 89.53,197.5 v93.98,193.05
  Bottom 0.508: v102.23,195.59 RN7.1 | IC48.20 156.21,193.05 157.48,194.32 167.64,194.32 168.91,193.05 IC49.20 | v197.49,187.97 189.87,195.59 RN8.1 | IC33.20 44.45,193.05 45.72,194.32 55.88,194.32 57.15,195.59 RN6.1 | v93.98,193.05 94.61,193.69 97.16,193.69 97.79,193.05 IC56.20
WLS  (via drill 0.61)
  Top 0.254: v109.22,193.05 v111.12,191.15 | v95.89,196.86 93.34,199.4 10.79,199.4 7.62,196.23 7.62,158.13 v46.99,158.13 | v109.22,185.43 IC47.15
  Bottom 0.254: v109.22,185.43 109.22,186.7 111.12,188.61 v111.12,191.15 | v109.22,193.05 107.31,194.96 102.87,194.96 102.23,194.32 101.6,194.32 99.06,196.86 v95.89,196.86 | v46.99,158.13 48.26,156.86 96.52,156.86 98.42,158.76 SV3.15
WRITING  (via drill 0.61)
  Top 0.254: v85.09,182.26 88.27,182.26 90.17,184.16 93.98,184.16 96.52,181.62 95.25,180.35 IC56.6 | v81.92,172.1 81.92,168.29 v90.81,168.29
  Bottom 0.254: v85.09,182.26 81.92,179.08 v81.92,172.1 | v90.81,168.29 90.81,163.21 91.44,163.21 92.71,161.94 92.71,159.4 91.44,159.4 SV3.9

### Text on the board
Bottom: RS08 | VRS | RF08 Debug | VRS | RS08 | VRS | RF08 | VRS
tPlace: RF08 | VRS
tValues: VRS | RF08 Debug | RS08 | VRS | RS08 | VRS